# EAGLE design OpenSourceLights_v17 (EAGLE 7.3.0)
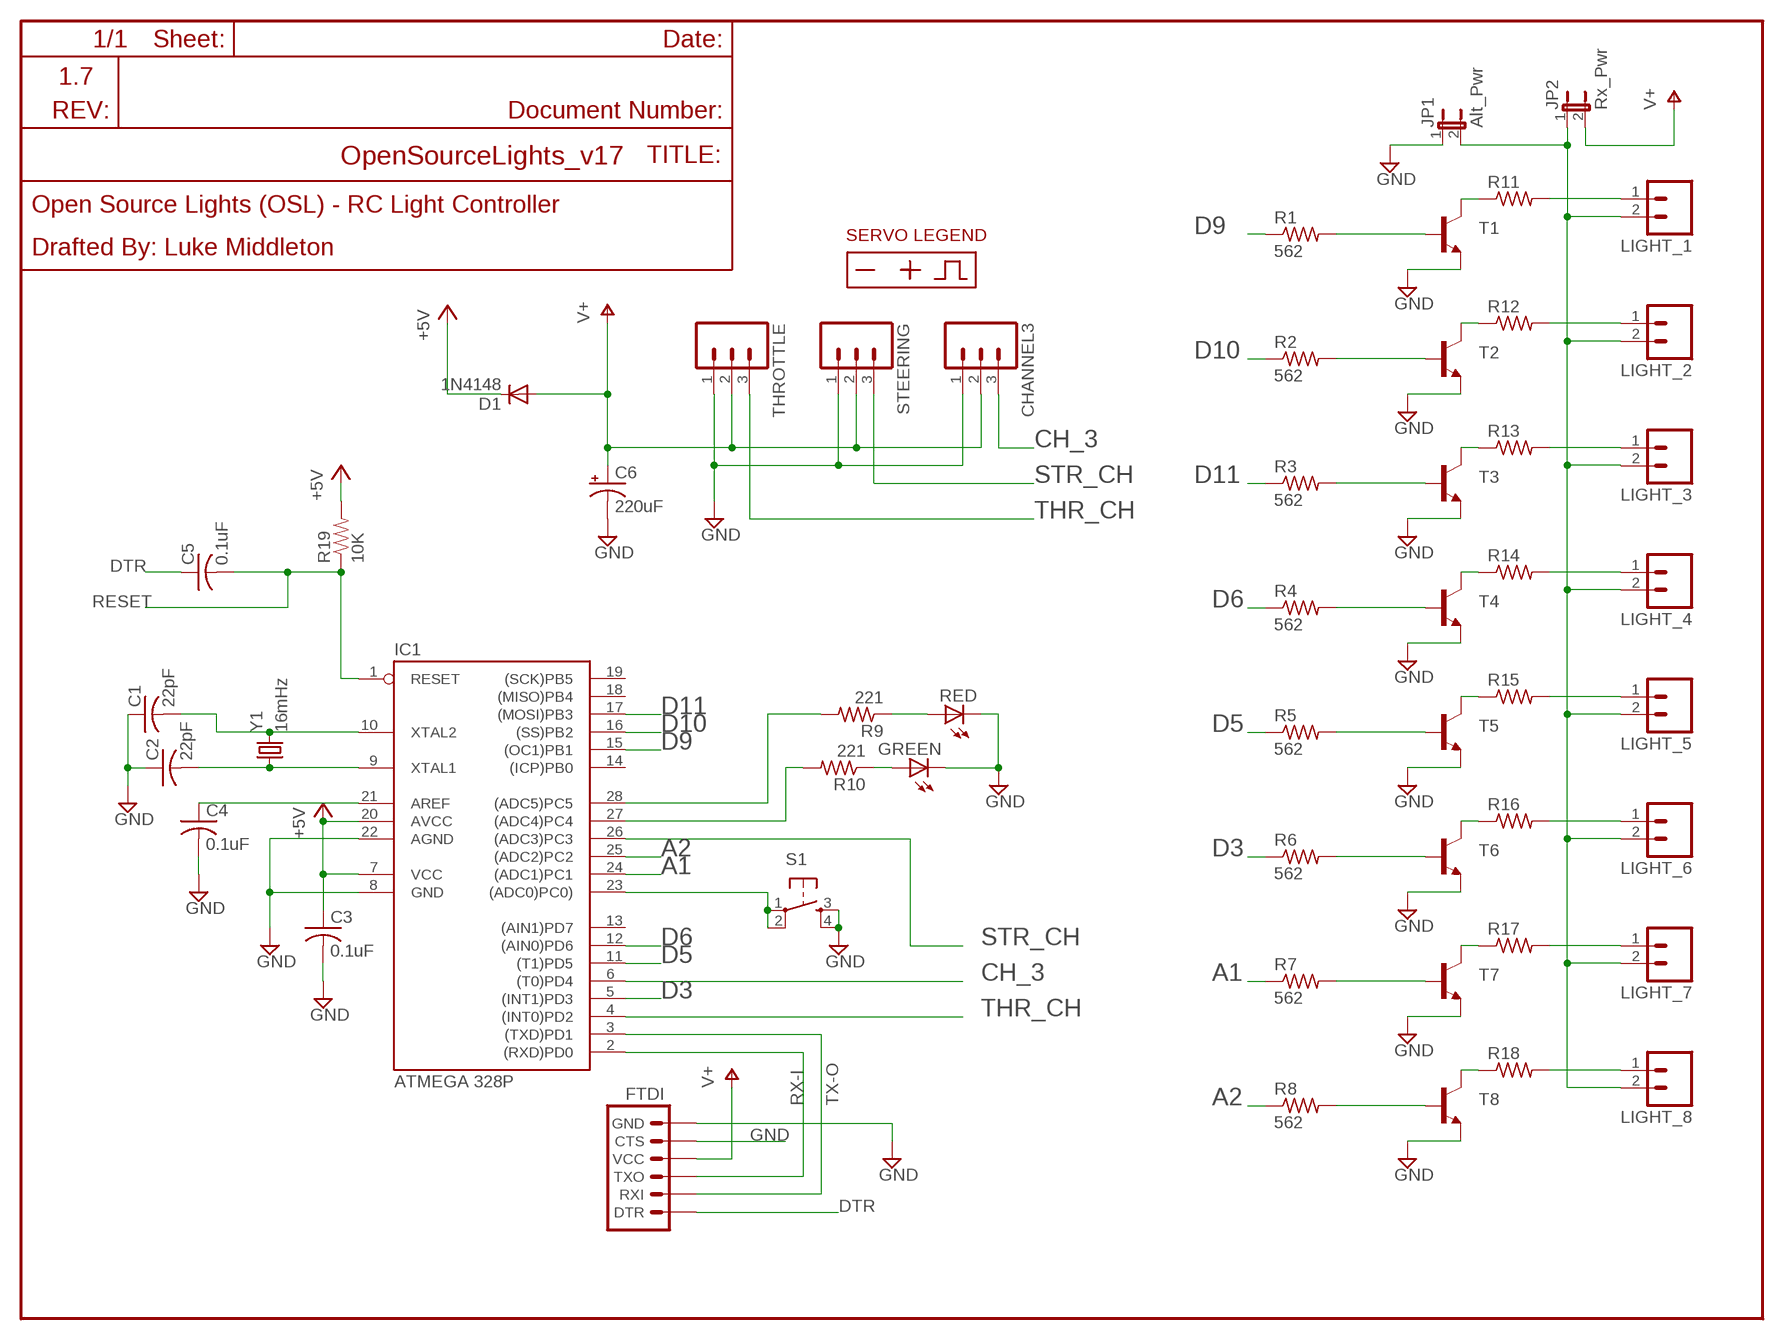
[diagram p0: schematic, sheet 1]

## Parts
C1  22pF  CAPACITORSMALL_THROUGH_HOLE  [C025-025X050]
C2  22pF  CAPACITORSMALL_THROUGH_HOLE  [C025-025X050]
C3  0.1uF  CAPACITORSMALL_THROUGH_HOLE  [C025-025X050]
C4  0.1uF  CAPACITORSMALL_THROUGH_HOLE  [C025-025X050]
C5  0.1uF  CAPACITORSMALL_THROUGH_HOLE  [C025-025X050]
C6  220uF  CPOL-USE5-10.5  [E5-10,5]
CHANNEL3  M03LOCK  [1X03_LOCK]
D1  1N4148  1N4148DO35-10  [DO35-10]
FTDI  ARDUINO_SERIAL_PROGRAMLOCK  [1X06_LOCK]
GREEN  LED3MM  [LED3MM]
IC1  ATMEGA 328P  AT90S4433P  [DIL28-3]
JP1  Alt_Pwr  JUMPER-2PTH  [1X02]
JP2  Rx_Pwr  JUMPER-2SMD-NO  [SJ_2S-NO]
LIGHT_1  M02JST-PTH-2_LARGEDRILL  [JST-2-PTH+]
LIGHT_2  M02JST-PTH-2_LARGEDRILL  [JST-2-PTH+]
LIGHT_3  M02JST-PTH-2_LARGEDRILL  [JST-2-PTH+]
LIGHT_4  M02JST-PTH-2_LARGEDRILL  [JST-2-PTH+]
LIGHT_5  M02JST-PTH-2_LARGEDRILL  [JST-2-PTH+]
LIGHT_6  M02JST-PTH-2_LARGEDRILL  [JST-2-PTH+]
LIGHT_7  M02JST-PTH-2_LARGEDRILL  [JST-2-PTH+]
LIGHT_8  M02JST-PTH-2_LARGEDRILL  [JST-2-PTH+]
R1  562  RESISTOR  [RESISTOR_VERTICAL]
R2  562  RESISTOR  [RESISTOR_VERTICAL]
R3  562  RESISTOR  [RESISTOR_VERTICAL]
R4  562  RESISTOR  [RESISTOR_VERTICAL]
R5  562  RESISTOR  [RESISTOR_VERTICAL]
R6  562  RESISTOR  [RESISTOR_VERTICAL]
R7  562  RESISTOR  [RESISTOR_VERTICAL]
R8  562  RESISTOR  [RESISTOR_VERTICAL]
R9  221  RESISTOR  [RESISTOR_VERTICAL]
R10  221  RESISTOR  [RESISTOR_VERTICAL]
R11  RESISTOR  [RESISTOR_VERTICAL]
R12  RESISTOR  [RESISTOR_VERTICAL]
R13  RESISTOR  [RESISTOR_VERTICAL]
R14  RESISTOR  [RESISTOR_VERTICAL]
R15  RESISTOR  [RESISTOR_VERTICAL]
R16  RESISTOR  [RESISTOR_VERTICAL]
R17  RESISTOR  [RESISTOR_VERTICAL]
R18  RESISTOR  [RESISTOR_VERTICAL]
R19  10K  RESISTORPTH-1/4W  [AXIAL-0.4]
RED  LED3MM  [LED3MM]
S1  TAC_SWITCHPTH  [TACTILE-PTH]
STEERING  M03LOCK  [1X03_LOCK]
T1  TRANSISTOR_NPNTH  [TO92]
T2  TRANSISTOR_NPNTH  [TO92]
T3  TRANSISTOR_NPNTH  [TO92]
T4  TRANSISTOR_NPNTH  [TO92]
T5  TRANSISTOR_NPNTH  [TO92]
T6  TRANSISTOR_NPNTH  [TO92]
T7  TRANSISTOR_NPNTH  [TO92]
T8  TRANSISTOR_NPNTH  [TO92]
THROTTLE  M03LOCK  [1X03_LOCK]
U$1  SYMBOLS_SERVONEG_POS_SIG  [SYMBOLS_SERVO_REVERSE]
Y1  16mHz  CRYSTALHC49US  [HC49US]

## Nets
+5V: C3.1 D1.C IC1.7(VCC) IC1.20(AVCC) R19.P$2
A1: IC1.24((ADC1)PC1) R7.1
A2: IC1.25((ADC2)PC2) R8.1
ALTPWR: JP1.2 JP2.1 LIGHT_1.2 LIGHT_2.2 LIGHT_3.2 LIGHT_4.2 LIGHT_5.2 LIGHT_6.2 LIGHT_7.2 LIGHT_8.2
CH_3: CHANNEL3.3 IC1.6((T0)PD4)
D3: IC1.5((INT1)PD3) R6.1
D5: IC1.11((T1)PD5) R5.1
D6: IC1.12((AIN0)PD6) R4.1
D9: IC1.15((OC1)PB1) R1.1
D10: IC1.16((SS)PB2) R2.1
D11: IC1.17((MOSI)PB3) R3.1
DTR: C5.1 FTDI.1(DTR)
GND: C1.1 C2.1 C3.2 C4.2 C6.- CHANNEL3.1 FTDI.5(CTS) FTDI.6(GND) GREEN.K(C) IC1.8(GND) IC1.22(AGND) JP1.1 RED.K(C) S1.3 S1.4 STEERING.1 T1.3(E) T2.3(E) T3.3(E) T4.3(E) T5.3(E) T6.3(E) T7.3(E) T8.3(E) THROTTLE.1
N$1: LIGHT_1.1 R11.2
N$2: LIGHT_2.1 R12.2
N$3: LIGHT_3.1 R13.2
N$4: LIGHT_4.1 R14.2
N$5: LIGHT_5.1 R15.2
N$6: LIGHT_6.1 R16.2
N$7: LIGHT_7.1 R17.2
N$8: LIGHT_8.1 R18.2
N$9: C1.2 IC1.10(XTAL2) Y1.2
N$10: R1.2 T1.2(B)
N$11: R2.2 T2.2(B)
N$12: R3.2 T3.2(B)
N$13: R4.2 T4.2(B)
N$14: R5.2 T5.2(B)
N$15: R6.2 T6.2(B)
N$16: R7.2 T7.2(B)
N$17: R8.2 T8.2(B)
N$18: C2.2 IC1.9(XTAL1) Y1.1
N$19: R11.1 T1.1(C)
N$20: R12.1 T2.1(C)
N$21: C4.1 IC1.21(AREF)
N$22: R13.1 T3.1(C)
N$23: R14.1 T4.1(C)
N$24: R15.1 T5.1(C)
N$25: R16.1 T6.1(C)
N$26: R17.1 T7.1(C)
N$27: R18.1 T8.1(C)
N$28: GREEN.A R10.1
N$39: IC1.23((ADC0)PC0)) S1.1 S1.2
N$40: R9.1 RED.A
N$41: IC1.27((ADC4)PC4) R10.2
N$42: IC1.28((ADC5)PC5) R9.2
RESET: C5.2 IC1.1(RESET) R19.P$1
RX-I: FTDI.3(TXO) IC1.2((RXD)PD0)
STR_CH: IC1.26((ADC3)PC3) STEERING.3
THR_CH: IC1.4((INT0)PD2) THROTTLE.3
TX-O: FTDI.2(RXI) IC1.3((TXD)PD1)
V+: C6.+ CHANNEL3.2 D1.A FTDI.4(VCC) JP2.2 STEERING.2 THROTTLE.2
Unconnected: IC1.13((AIN1)PD7) IC1.14((ICP)PB0) IC1.18((MISO)PB4) IC1.19((SCK)PB5)

## Notes on the sheet
- 1.7
- Open Source Lights (OSL) - RC Light Controller
- Drafted By: Luke Middleton

## Library data of the parts
C1-C5 = Altimeter:CAPACITOR
C6 = rcl:CPOL-US: POLARIZED CAPACITOR, American symbol
CHANNEL3 STEERING THROTTLE = SparkFun:M03: Header 3 Standard 3-pin 0.1" header. Use with straight break away headers (SKU : PRT-00116), right angle break away headers (PRT-00553), swiss pins (PRT-00743), machine pins (PRT-00117), and female headers (PRT-00115). Molex polarized connector foot print use with SKU : PRT-08232 with associated crimp pins and housings.
D1 = diode:1N4148: DIODE high speed (Philips)
FTDI = SparkFun:ARDUINO_SERIAL_PROGRAM
GREEN RED = SparkFun:LED: LEDs Standard schematic elements and footprints for 5mm, 3mm, 1206, and 0603 sized LEDs. 5mm - Spark Fun Electronics SKU : COM-00529 (and others)
IC1 = atmel:AT90S4433: MICROCONTROLLER 4 Kbytes FLASH 128 bytes SRAM 256 bytes EEPROM UART 6-channel 10 bit ADC; OC_FARNELL: unknown; OC_NEWARK: unknown
JP1 JP2 = SparkFun:JUMPER-2: Jumper Basic 0.1" spaced jumper. Use with breakaway headers.
LIGHT_1-LIGHT_8 = SparkFun:M02: Header 2 Standard 2-pin 0.1" header. Use with straight break away headers (SKU : PRT-00116), right angle break away headers (PRT-00553), swiss pins (PRT-00743), machine pins (PRT-00117), and female headers (PRT-00115). Molex polarized connector foot print use with SKU : PRT-08233 with associated crimp pins and housings.
R1-R18 = Altimeter:RESISTOR
R19 = SparkFun:RESISTOR: Resistor Basic schematic elements and footprints for 0603, 1206, and PTH resistors.
S1 = SparkFun:TAC_SWITCH: Momentary Switch Button commonly used for reset or general input. Spark Fun Electronics SKU : COM-00097
T1-T8 = Altimeter:TRANSISTOR_NPN
U$1 = Altimeter:SYMBOLS_SERVO
Y1 = SparkFun:CRYSTAL: Crystals Various standard crystals. Proven footprints. Spark Fun Electronics SKU : COM-00534

## Board
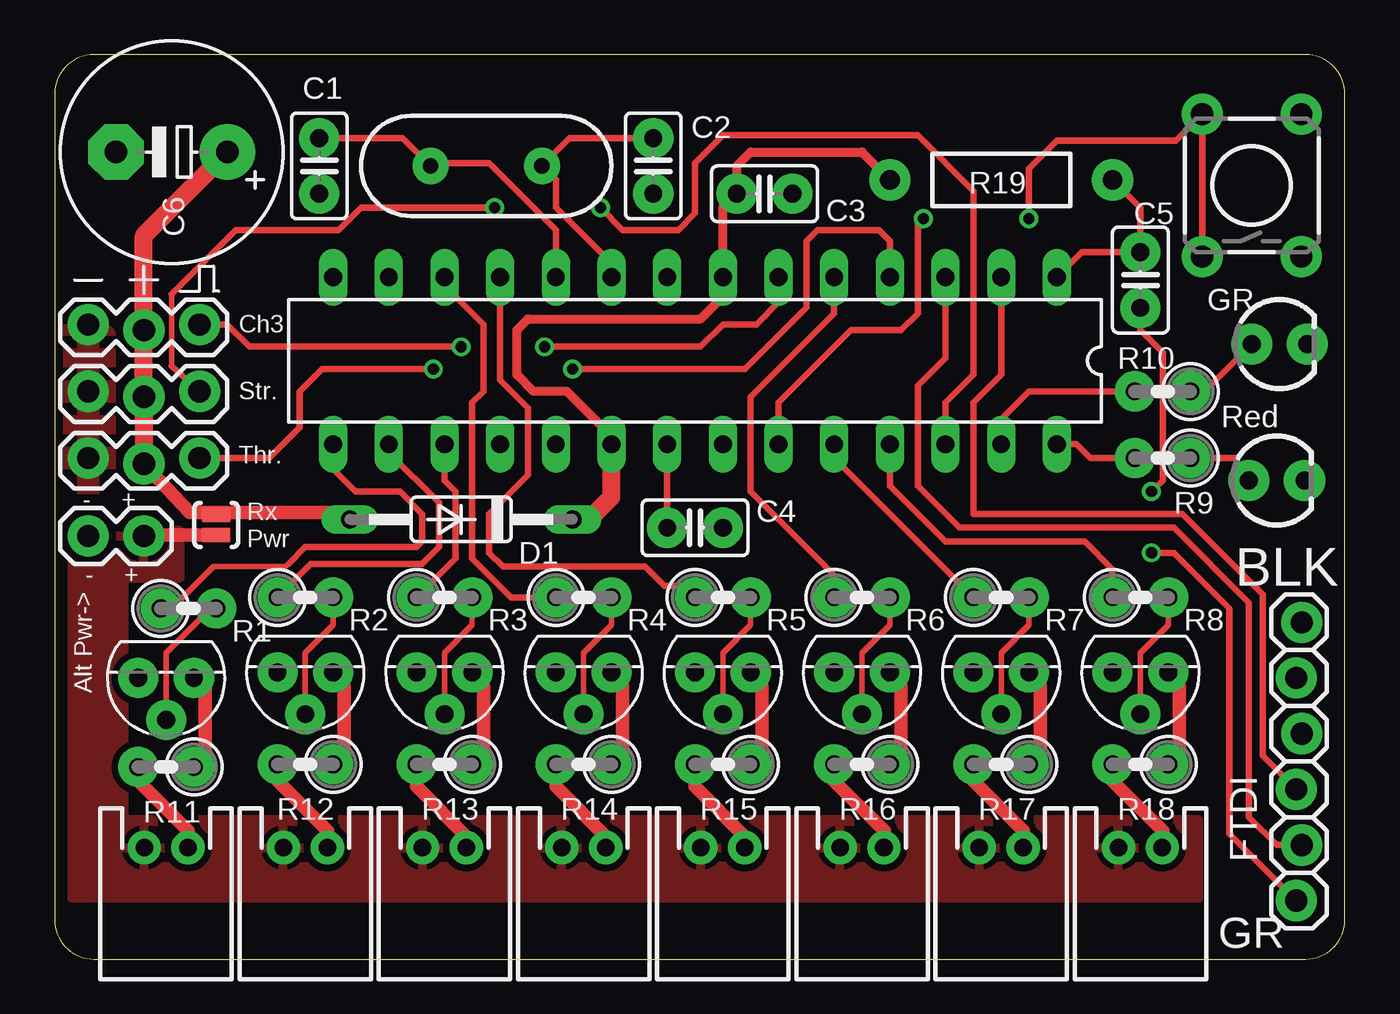
[diagram p1: board, top side]
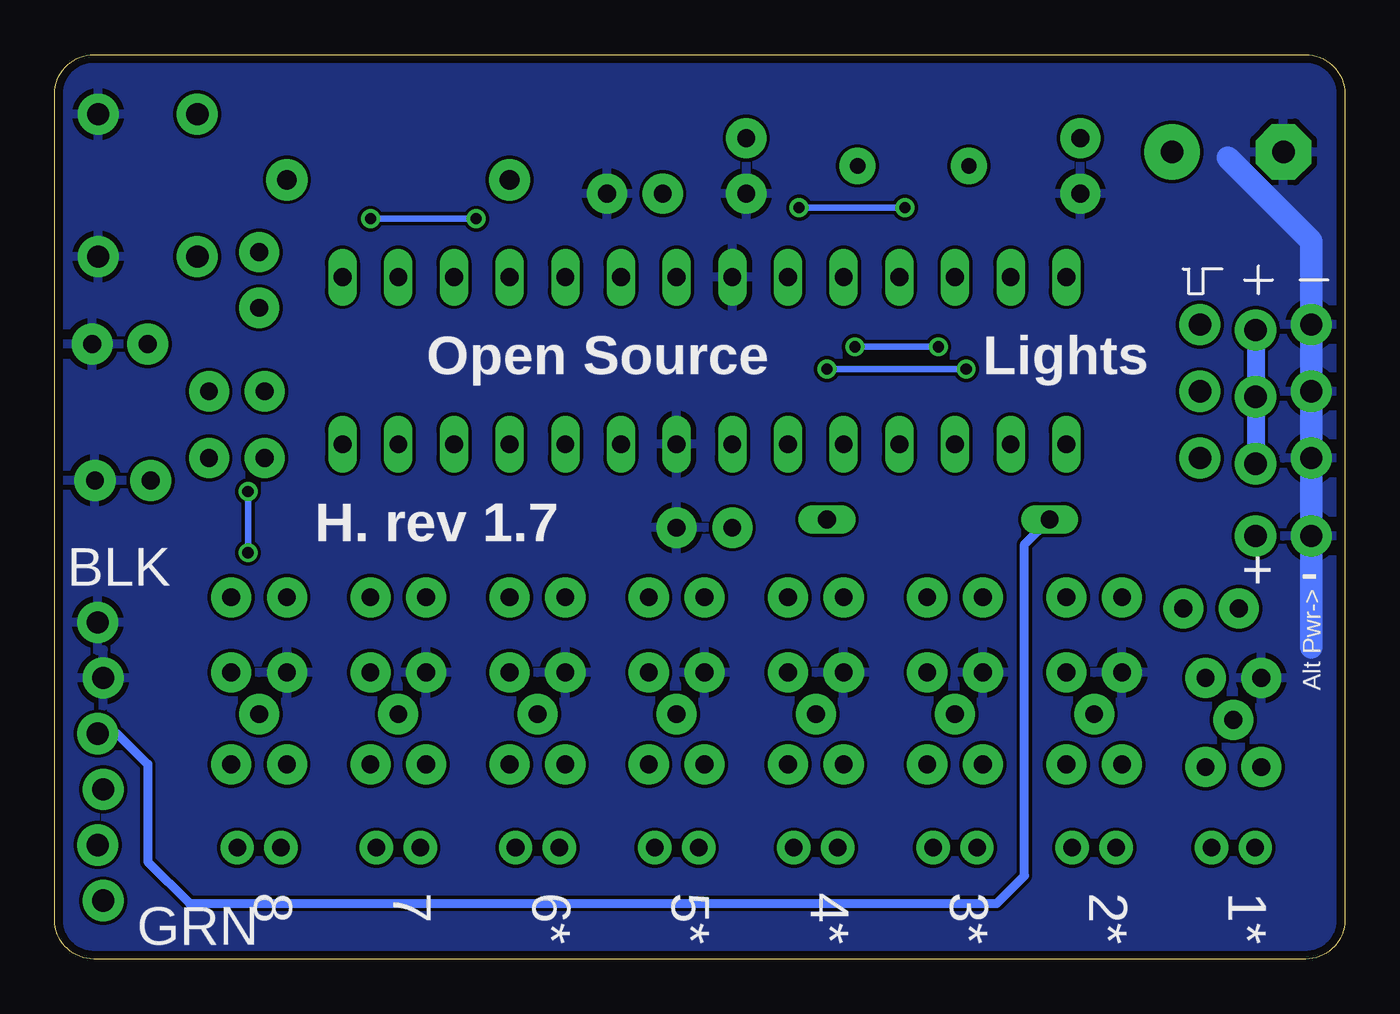
[diagram p2: board, bottom side, seen from below]

Size 58.85 x 41.27 mm. Coordinates in mm from the lower left corner, seen from the top.
Outline: 57.07,41.27 1.78,41.27 arc90 0,39.49 0,1.78 arc90 1.78,0 57.07,0 arc90 58.85,1.78 58.85,39.49 arc90 57.07,41.27
Copper layers (1*16): Top 0.0356mm / dielectric 1.5011mm / Bottom 0.0356mm
Design rules "LaenPCBOrder *": minimum track width 8mil, minimum drill 13mil, track to track 6mil, track to pad 6mil, pad to pad 6mil, via to via 6mil, smd to smd 6mil, copper to edge 15mil, drill to drill 8mil, minimum pad ring 7mil, minimum via ring 7mil, stop-mask expansion 3mil, vias tented up to drill 25mil, thermal gap 10mil

### Footprints (pad centres in the part's own frame; a part is rotated, then mirrored left to right if it is on the bottom)
C025-025X050 = drill 0.813 pad 1.829: 1 -1.27,0; 2 1.27,0
E5-10,5 = drill 1.016 pad 2.54: + -2.54,0 | drill 1.016 pad 2.54 octagon: - 2.54,0
1X03_LOCK = drill 1.016 pad 1.88: 1 0,0.127; 2 2.54,-0.127; 3 5.08,0.127
DO35-10 = drill 0.813 long: A 5.08,0; C -5.08,0
1X06_LOCK = drill 1.016 pad 1.88: 1 0,0; 2 2.54,-0.254; 3 5.08,0; 4 7.62,-0.254; 5 10.16,0; 6 12.7,-0.254
LED3MM = drill 0.813 pad 1.88: A -1.27,0; K 1.27,0
DIL28-3 = drill 0.813 long: 1 -16.51,-3.81; 2 -13.97,-3.81; 3 -11.43,-3.81; 4 -8.89,-3.81; 5 -6.35,-3.81; 6 -3.81,-3.81; 7 -1.27,-3.81; 8 1.27,-3.81; 9 3.81,-3.81; 10 6.35,-3.81; 11 8.89,-3.81; 12 11.43,-3.81; 13 13.97,-3.81; 14 16.51,-3.81; 15 16.51,3.81; 16 13.97,3.81; 17 11.43,3.81; 18 8.89,3.81; 19 6.35,3.81; 20 3.81,3.81; 21 1.27,3.81; 22 -1.27,3.81; 23 -3.81,3.81; 24 -6.35,3.81; 25 -8.89,3.81; 26 -11.43,3.81; 27 -13.97,3.81; 28 -16.51,3.81
1X02 = drill 1.016 pad 1.88: 1 0,0; 2 2.54,0
SJ_2S-NO = smd 0.635 x 1.27: 1 -0.45,0; 2 0.45,0
JST-2-PTH+ = drill 0.8 pad 1.524: 1 -1,0; 2 1,0
RESISTOR_VERTICAL = drill 0.813 pad 1.829: 1 -1.27,0; 2 1.27,0
AXIAL-0.4 = drill 0.9 pad 1.88: P$1 -5.08,0; P$2 5.08,0
TACTILE-PTH = drill 1.016 pad 1.88: 1 -3.251,2.261; 2 3.251,2.261; 3 -3.251,-2.261; 4 3.251,-2.261
TO92 = drill 0.813 pad 1.829: 1 -1.27,0; 2 0,1.905; 3 1.27,0
HC49US = drill 0.7 pad 1.651: 1 -2.54,0; 2 2.54,0

### Placement (x,y rotation side)
C1  12.06,36.2 90 top
C2  27.3,36.2 90 top
C3  32.38,34.92 0 top
C4  29.21,19.68 0 top
C5  49.53,30.99 90 top
C6  5.33,36.83 180 top
CHANNEL3  1.52,28.83 0 top
D1  18.54,20.07 180 top
FTDI  56.64,2.67 90 top
GREEN  55.88,28.07 0 top
IC1  29.21,27.3 180 top
JP1  1.52,19.3 0 top
JP2  7.37,19.81 90 top
LIGHT_1  5.08,5.08 180 top
LIGHT_2  11.43,5.08 180 top
LIGHT_3  17.78,5.08 180 top
LIGHT_4  24.13,5.08 180 top
LIGHT_5  30.48,5.08 180 top
LIGHT_6  36.83,5.08 180 top
LIGHT_7  43.18,5.08 180 top
LIGHT_8  49.53,5.08 180 top
R1  6.1,16 0 top
R2  11.43,16.51 0 top
R3  17.78,16.51 0 top
R4  24.13,16.51 0 top
R5  30.48,16.51 0 top
R6  36.83,16.51 0 top
R7  43.18,16.51 0 top
R8  49.53,16.51 0 top
R9  50.55,22.86 180 top
R10  50.55,25.91 180 top
R11  5.08,8.76 180 top
R12  11.43,8.89 180 top
R13  17.78,8.89 180 top
R14  24.13,8.89 180 top
R15  30.48,8.89 180 top
R16  36.83,8.89 180 top
R17  43.18,8.89 180 top
R18  49.53,8.89 180 top
R19  43.18,35.56 180 top
RED  55.75,21.84 0 top
S1  54.61,35.31 90 top
STEERING  1.52,25.78 0 top
T1  5.08,12.83 180 top
T2  11.43,13.08 180 top
T3  17.78,13.08 180 top
T4  24.13,13.08 180 top
T5  30.48,13.08 180 top
T6  36.83,13.08 180 top
T7  43.18,13.08 180 top
T8  49.53,13.08 180 top
THROTTLE  1.52,22.73 0 top
U$1  4.06,30.99 0 top
U$2  SYMBOLS_SERVONEG_POS_SIG  [SYMBOLS_SERVO_REVERSE]  3.94,30.99 180 bottom
Y1  19.68,36.2 180 top

### Tracks (layer width: path | path; a pad name or v marks a point on that pad's centre or on a via)
+5V
  Top 0.406: R19.P$2 36.83,36.83 31.75,36.83 31.11,36.2 C3.1 30.48,34.29 IC1.7 30.48,30.23 29.46,29.21 21.59,29.21 21.08,28.7 21.08,26.67 21.84,25.91 23.37,25.91 25.4,23.88 IC1.20
  Top 0.813: D1.C 24.38,20.07 25.4,21.08 IC1.20
A1
  Top 0.305: IC1.24 35.56,22.86 R7.1
A2
  Top 0.305: IC1.25 38.1,21.59 40.64,19.05 46.99,19.05 48.26,17.78 R8.1
ALTPWR
  Top 0.61: 4.39,19.49 JP1.2 4.26,19.36 JP2.1
  pour Top (isolate 0.305): 0.76,2.79 52.2,2.79 52.2,6.35 3.17,6.35 3.17,17.4 5.71,17.4 5.71,19.56 0.76,19.68
CH_3  (via drill 0.51)
  Top 0.305: v18.54,27.94 8.89,27.94 7.87,28.96 CHANNEL3.3 | v22.35,27.94 29.46,27.94 30.48,28.96 32,28.96 33.02,29.97 IC1.6
  Bottom 0.305: v18.54,27.94 v22.35,27.94
D3
  Top 0.305: IC1.5 35.56,29.46 31.75,25.65 31.75,21.34 35.56,17.53 R6.1
D5
  Top 0.305: IC1.11 20.32,26.42 21.59,25.15 21.59,22.1 19.81,20.32 19.81,18.54 20.45,17.91 26.92,17.91 27.81,17.02 28.7,17.02 R5.1
D6
  Top 0.305: IC1.12 17.78,30.73 19.56,28.96 19.56,25.91 19.05,25.4 19.05,18.29 20.83,16.51 R4.1
D9
  Top 0.254: R1.1 5.33,16 7.24,17.91 10.54,17.91 10.67,18.03
  Top 0.305: IC1.15 12.7,22.35 13.72,21.34 15.75,21.34 16.76,20.32 16.76,19.05 16.51,18.8 11.43,18.8 10.67,18.03
D10
  Top 0.305: IC1.16 15.24,23.11 17.53,20.83 17.53,18.8 16.76,18.03 11.68,18.03 R2.1
D11
  Top 0.305: R3.1 18.29,18.29 18.29,21.34 17.78,21.84 IC1.17
DTR  (via drill 0.51)
  Top 0.305: C5.1 49.53,28.7 50.55,27.69 50.55,21.84 v50.04,21.34 | FTDI.1 53.59,5.71 53.59,16 51.05,18.54 v50.04,18.54
  Bottom 0.305: v50.04,18.54 v50.04,21.34
GND
  Bottom 1.016: 1.52,14.22 THROTTLE.1 1.52,32.77 5.33,36.58 | 3.68,12.95 T1.3
  pour Bottom (isolate 0.127): 0,0 58.93,0 58.93,41.27 0,41.27
  pour Top: 0.51,28.45 0.51,21.72 2.29,21.72 2.29,28.45
N$1
  Top 0.61: R11.2 3.81,8.13 6.1,5.84 6.1,5.1 LIGHT_1.1
N$2
  Top 0.61: R12.2 10.16,8.13 12.45,5.84 12.45,5.1 LIGHT_2.1
N$3
  Top 0.61: R13.2 16.51,7.87 18.8,5.59 18.8,5.1 LIGHT_3.1
N$4
  Top 0.61: R14.2 22.86,7.87 25.15,5.59 25.15,5.1 LIGHT_4.1
N$5
  Top 0.61: R15.2 29.21,7.87 31.5,5.59 31.5,5.1 LIGHT_5.1
N$6
  Top 0.61: R16.2 35.56,8.13 37.85,5.84 37.85,5.1 LIGHT_6.1
N$7
  Top 0.61: R17.2 41.91,8.13 44.2,5.84 44.2,5.1 LIGHT_7.1
N$8
  Top 0.61: R18.2 48.26,8.13 50.55,5.84 50.55,5.1 LIGHT_8.1
N$9
  Top 0.305: C1.2 15.88,37.47 Y1.2 17.27,36.32 19.81,36.32 22.86,33.27 IC1.10
N$10
  Top 0.254: R1.2 7.11,16 5.08,13.97 T1.2
N$11
  Top 0.254: R2.2 12.7,15.24 11.43,13.97 T2.2
N$12
  Top 0.254: R3.2 19.05,15.24 17.78,13.97 T3.2
N$13
  Top 0.254: R4.2 25.4,15.24 24.13,13.97 T4.2
N$14
  Top 0.254: R5.2 31.75,15.24 30.48,13.97 T5.2
N$15
  Top 0.254: R6.2 38.1,15.24 36.83,13.97 T6.2
N$16
  Top 0.254: R7.2 44.45,15.24 43.18,13.97 T7.2
N$17
  Top 0.254: R8.2 50.8,15.24 49.53,13.97 T8.2
N$18
  Top 0.305: IC1.9 25.4,31.75 22.86,34.29 22.86,35.56 Y1.1 23.5,37.47 C2.2
N$19
  Top 0.61: T1.1 6.35,12.95 6.86,12.45 6.86,9.27 R11.1
N$20
  Top 0.61: T2.1 12.7,12.95 13.21,12.45 13.21,9.4 R12.1
N$21
  Top 0.305: C4.1 IC1.21
N$22
  Top 0.61: T3.1 19.05,12.95 19.56,12.45 19.56,9.4 R13.1
N$23
  Top 0.61: T4.1 25.4,12.95 25.91,12.45 25.91,9.4 R14.1
N$24
  Top 0.61: T5.1 31.75,12.95 32.26,12.45 32.26,9.4 R15.1
N$25
  Top 0.61: T6.1 38.1,12.95 38.61,12.45 38.61,9.4 R16.1
N$26
  Top 0.61: T7.1 44.45,12.95 44.96,12.45 44.96,9.4 R17.1
N$27
  Top 0.61: T8.1 50.8,12.95 51.31,12.45 51.31,9.4 R18.1
N$28
  Top 0.305: R10.1 52.45,25.91 GREEN.A
N$39  (via drill 0.51)
  Top 0.305: IC1.23 33.02,25.4 36.32,28.7 38.61,28.7 39.37,29.46 39.37,33.53 v39.62,33.78 | v44.45,33.78 44.45,36.07 45.72,37.34 51.16,37.34 S1.2 S1.1
  Bottom 0.305: v39.62,33.78 v44.45,33.78
N$40
  Top 0.305: R9.1 53.85,22.86 RED.A
N$41
  Top 0.305: IC1.27 43.18,24.64 44.45,25.91 R10.2
N$42
  Top 0.305: IC1.28 46.61,23.5 47.24,22.86 R9.2
RESET
  Top 0.305: IC1.1 46.86,32.26 C5.2 49.53,34.29 R19.P$1
RX-I
  Top 0.305: IC1.2 43.18,26.67 41.91,25.4 41.91,20.32 51.44,20.32 55.12,16.64 55.12,9.27 FTDI.3
STR_CH  (via drill 0.51)
  Top 0.254: 5.33,27.05 5.33,30.35
  Top 0.305: v24.89,34.29 25.91,33.27 28.45,33.27 29.21,34.04 29.21,36.32 30.48,37.59 39.37,37.59 41.91,35.05 41.91,26.67 40.64,25.4 IC1.26 | v20.07,34.29 13.97,34.29 12.95,33.27 8.26,33.27 5.33,30.35 | STEERING.3 5.33,27.05
  Bottom 0.305: v20.07,34.29 v24.89,34.29
THR_CH  (via drill 0.51)
  Top 0.305: THROTTLE.3 9.78,22.86 11.18,24.26 11.18,25.91 12.19,26.92 v17.27,26.92 | IC1.4 38.1,32.77 37.59,33.27 34.8,33.27 34.29,32.77 34.29,29.72 31.5,26.92 v23.62,26.92
  Bottom 0.305: v17.27,26.92 v23.62,26.92
TX-O
  Top 0.305: FTDI.2 55.75,5.21 54.48,6.48 54.48,16.26 51.05,19.68 41.27,19.68 39.37,21.59 39.37,26.16 40.64,27.43 IC1.3
V+
  Top 0.508: THROTTLE.2 4.19,22.48
  Top 0.61: THROTTLE.2 6.15,20.39 7.87,20.39 JP2.2 8.13,20.39 13.14,20.39 D1.A
  Top 0.813: C6.+ 4.06,33.02 CHANNEL3.2 STEERING.2 THROTTLE.2
  Bottom 0.406: FTDI.4 56.01,10.29 54.61,8.89 54.61,4.45 52.7,2.54 15.88,2.54 14.61,3.81 14.61,18.92 D1.A
  Bottom 0.813: CHANNEL3.2 THROTTLE.2

### Text on the board
tPlace: GR | Ch3 | Str. | Red | Thr. | - | + | Rx / Pwr | Alt Pwr-> | - | + | BLK | GR
bPlace: Lights | Open Source | H. rev 1.7 | Alt Pwr-> | - | + | BLK | 1* | 2* | 3* | 4* | 5* | 6* | 7 | 8 | GRN